# EAGLE design BMS Enerdel Adapter Fuse Holder rev1 (EAGLE 9.2.2)
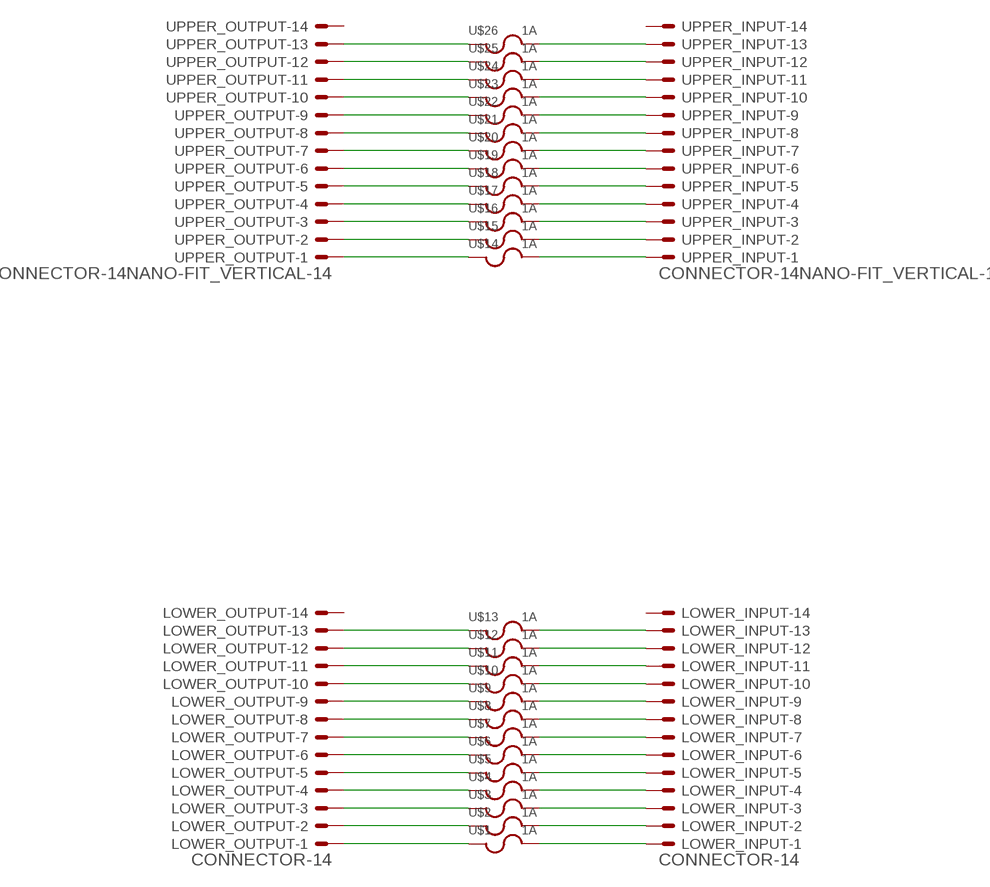
[diagram p0: schematic, sheet 1]

## Parts
LOWER_INPUT  CONNECTOR-14  [MINIFIT_5566-14]
LOWER_OUTPUT  CONNECTOR-14  [MINIFIT_5566-14]
U$1  1A  FUSE_5X20MM  [0751.0110]
U$2  1A  FUSE_5X20MM  [0751.0110]
U$3  1A  FUSE_5X20MM  [0751.0110]
U$4  1A  FUSE_5X20MM  [0751.0110]
U$5  1A  FUSE_5X20MM  [0751.0110]
U$6  1A  FUSE_5X20MM  [0751.0110]
U$7  1A  FUSE_5X20MM  [0751.0110]
U$8  1A  FUSE_5X20MM  [0751.0110]
U$9  1A  FUSE_5X20MM  [0751.0110]
U$10  1A  FUSE_5X20MM  [0751.0110]
U$11  1A  FUSE_5X20MM  [0751.0110]
U$12  1A  FUSE_5X20MM  [0751.0110]
U$13  1A  FUSE_5X20MM  [0751.0110]
U$14  1A  FUSE_5X20MM  [0751.0110]
U$15  1A  FUSE_5X20MM  [0751.0110]
U$16  1A  FUSE_5X20MM  [0751.0110]
U$17  1A  FUSE_5X20MM  [0751.0110]
U$18  1A  FUSE_5X20MM  [0751.0110]
U$19  1A  FUSE_5X20MM  [0751.0110]
U$20  1A  FUSE_5X20MM  [0751.0110]
U$21  1A  FUSE_5X20MM  [0751.0110]
U$22  1A  FUSE_5X20MM  [0751.0110]
U$23  1A  FUSE_5X20MM  [0751.0110]
U$24  1A  FUSE_5X20MM  [0751.0110]
U$25  1A  FUSE_5X20MM  [0751.0110]
U$26  1A  FUSE_5X20MM  [0751.0110]
UPPER_INPUT  CONNECTOR-14NANO-FIT_VERTICAL-14  [NANO-FIT_VERTICAL-14]
UPPER_OUTPUT  CONNECTOR-14NANO-FIT_VERTICAL-14  [NANO-FIT_VERTICAL-14]

## Nets
N$1: LOWER_OUTPUT.1 U$1.L1 U$1.L2
N$2: LOWER_OUTPUT.2 U$2.L1 U$2.L2
N$3: LOWER_OUTPUT.3 U$3.L1 U$3.L2
N$4: LOWER_OUTPUT.4 U$4.L1 U$4.L2
N$5: LOWER_OUTPUT.5 U$5.L1 U$5.L2
N$6: LOWER_OUTPUT.6 U$6.L1 U$6.L2
N$7: LOWER_OUTPUT.7 U$7.L1 U$7.L2
N$8: LOWER_OUTPUT.8 U$8.L1 U$8.L2
N$9: LOWER_OUTPUT.9 U$9.L1 U$9.L2
N$10: LOWER_OUTPUT.10 U$10.L1 U$10.L2
N$11: LOWER_OUTPUT.11 U$11.L1 U$11.L2
N$12: LOWER_OUTPUT.12 U$12.L1 U$12.L2
N$13: LOWER_OUTPUT.13 U$13.L1 U$13.L2
N$14: U$14.L1 U$14.L2 UPPER_OUTPUT.P$1
N$15: U$15.L1 U$15.L2 UPPER_OUTPUT.P$2
N$16: U$16.L1 U$16.L2 UPPER_OUTPUT.P$3
N$17: U$17.L1 U$17.L2 UPPER_OUTPUT.P$4
N$18: U$18.L1 U$18.L2 UPPER_OUTPUT.P$5
N$19: U$19.L1 U$19.L2 UPPER_OUTPUT.P$6
N$20: U$20.L1 U$20.L2 UPPER_OUTPUT.P$7
N$21: U$21.L1 U$21.L2 UPPER_OUTPUT.P$8
N$23: U$22.L1 U$22.L2 UPPER_OUTPUT.P$9
N$24: U$23.L1 U$23.L2 UPPER_OUTPUT.P$10
N$25: U$24.L1 U$24.L2 UPPER_OUTPUT.P$11
N$26: U$25.L1 U$25.L2 UPPER_OUTPUT.P$12
N$27: U$26.L1 U$26.L2 UPPER_OUTPUT.P$13
N$29: LOWER_INPUT.1 U$1.R1 U$1.R2
N$30: LOWER_INPUT.2 U$2.R1 U$2.R2
N$31: LOWER_INPUT.3 U$3.R1 U$3.R2
N$32: LOWER_INPUT.4 U$4.R1 U$4.R2
N$33: LOWER_INPUT.5 U$5.R1 U$5.R2
N$34: LOWER_INPUT.6 U$6.R1 U$6.R2
N$35: LOWER_INPUT.7 U$7.R1 U$7.R2
N$36: LOWER_INPUT.8 U$8.R1 U$8.R2
N$37: LOWER_INPUT.9 U$9.R1 U$9.R2
N$38: LOWER_INPUT.10 U$10.R1 U$10.R2
N$39: LOWER_INPUT.11 U$11.R1 U$11.R2
N$40: LOWER_INPUT.12 U$12.R1 U$12.R2
N$41: LOWER_INPUT.13 U$13.R1 U$13.R2
N$42: U$14.R1 U$14.R2 UPPER_INPUT.P$1
N$43: U$15.R1 U$15.R2 UPPER_INPUT.P$2
N$44: U$16.R1 U$16.R2 UPPER_INPUT.P$3
N$45: U$17.R1 U$17.R2 UPPER_INPUT.P$4
N$46: U$18.R1 U$18.R2 UPPER_INPUT.P$5
N$47: U$19.R1 U$19.R2 UPPER_INPUT.P$6
N$48: U$20.R1 U$20.R2 UPPER_INPUT.P$7
N$49: U$21.R1 U$21.R2 UPPER_INPUT.P$8
N$50: U$22.R1 U$22.R2 UPPER_INPUT.P$9
N$51: U$23.R1 U$23.R2 UPPER_INPUT.P$10
N$52: U$24.R1 U$24.R2 UPPER_INPUT.P$11
N$53: U$25.R1 U$25.R2 UPPER_INPUT.P$12
N$54: U$26.R1 U$26.R2 UPPER_INPUT.P$13
Unconnected: LOWER_INPUT.14 LOWER_OUTPUT.14 UPPER_INPUT.P$14 UPPER_OUTPUT.P$14

## Library data of the parts
LOWER_INPUT LOWER_OUTPUT UPPER_INPUT UPPER_OUTPUT = HyTechDevices:CONNECTOR-14: Mini-Fit Junior connector 14 pole Source: http://www.molex.com
U$1-U$26 = HyTechDevices:FUSE: Fuse/Fuseclips Keystone Electronics 3568 Fuse Mouser Part <http://www.mouser.com/ProductDetail/Keystone-Electronics/3568> Datasheet <http://www.mouser.com/ds/2/215/568-742601.pdf> Bussman/Eaton Midget Fuse Clip 1A3400 <http://www.mouser.com/ProductDetail/Bussmann-Eaton/BK-1A3400-09-R/?qs=sGAEpiMZZMuG%252bgnN5hGYGzzlAelq2OxnKqVSMVjq8I4%3d> Schurter 0751.0110 Brass Fuse Clip Datasheet <http://www.mouser.com/ds/2/358/typ_OG__Clip__5x20-2553.pdf>

## Board
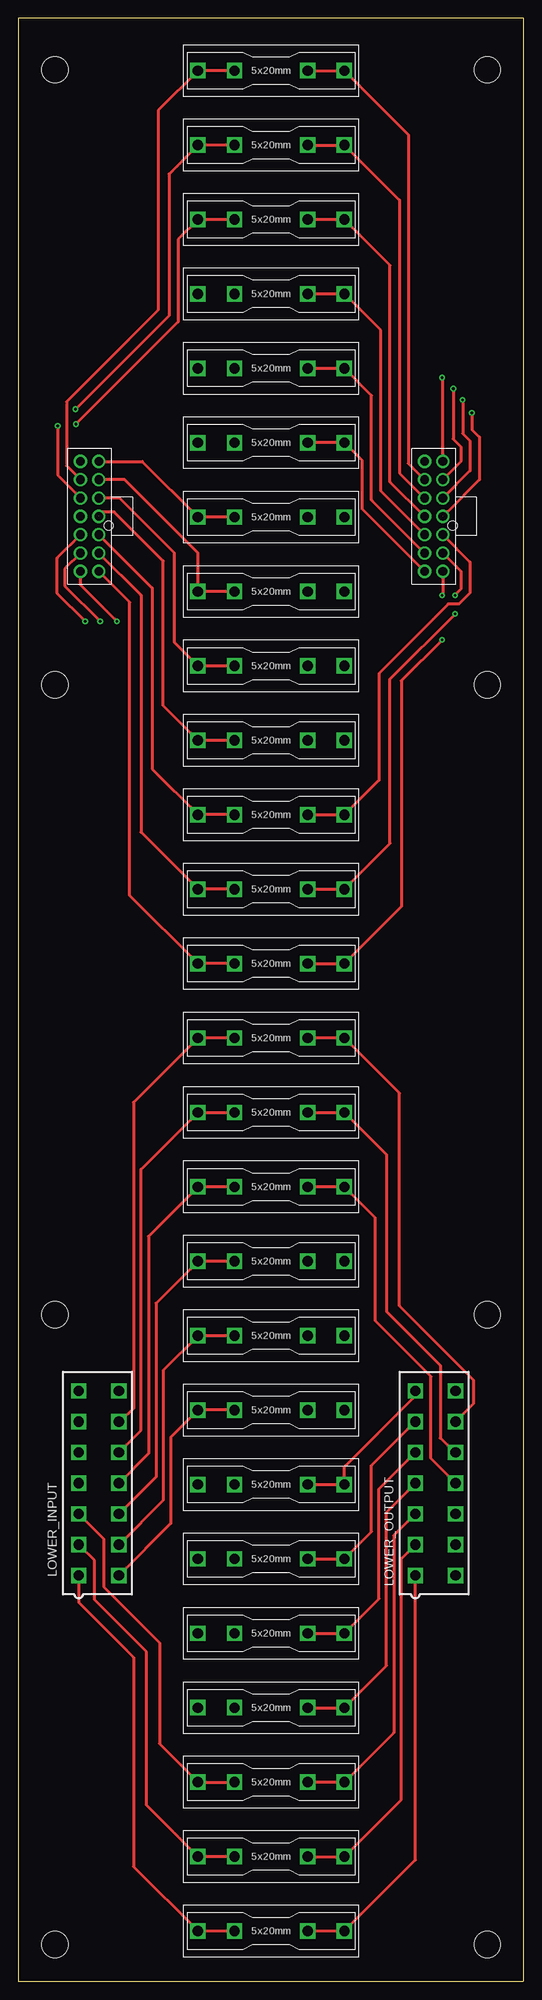
[diagram p1: board, top side]
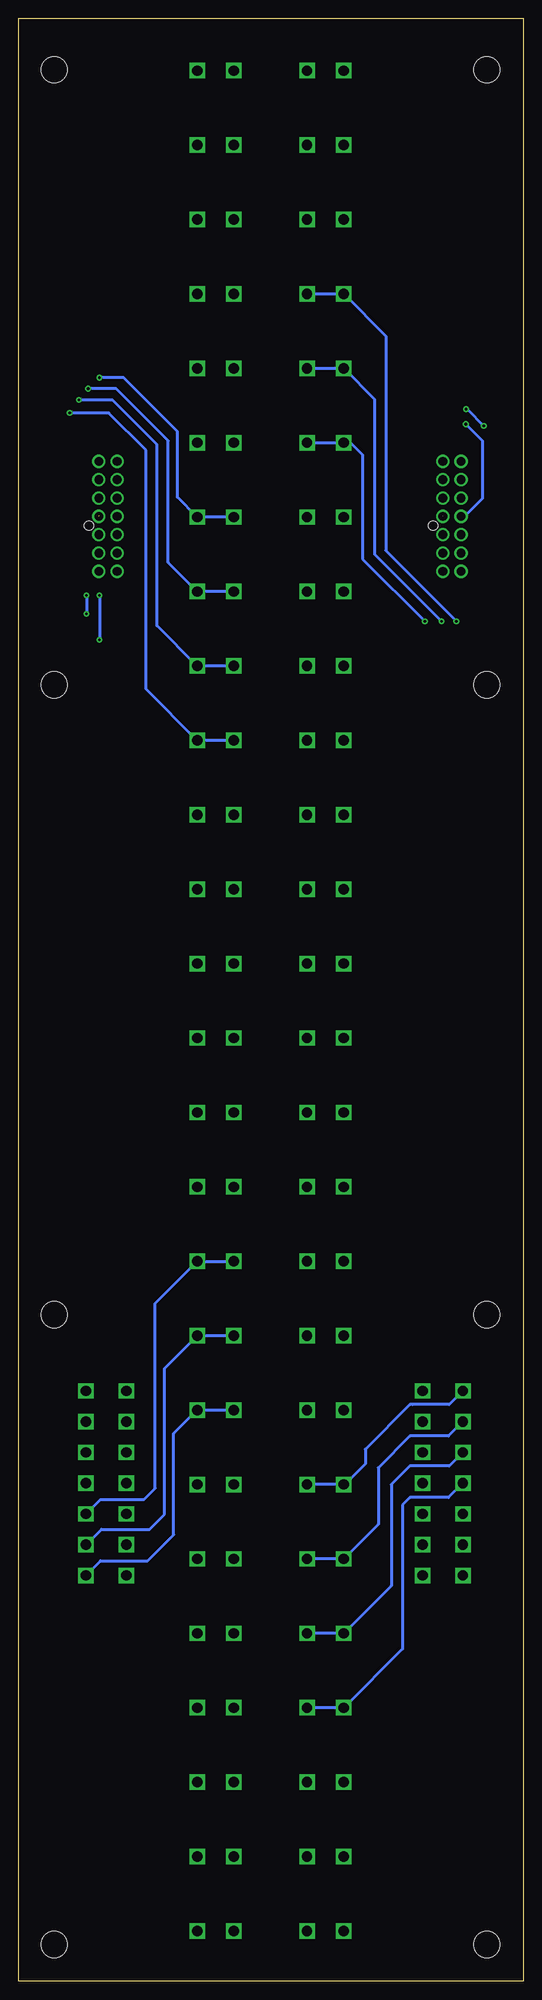
[diagram p2: board, bottom side, seen from below]

Size 69 x 268 mm. Coordinates in mm from the lower left corner, seen from the top.
Outline: 0,202.72 0,162.78
Outline: 0,122.78 0,82.84
Outline: 0,268 0,0 69,0 69,268 0,268
Copper layers (1*16): Top 0.035mm / dielectric 1.5mm / Bottom 0.035mm
Design rules "DRC Advanced Circuits *": minimum track width 6mil, minimum drill 15mil, track to track 24mil, track to pad 24mil, pad to pad 24mil, via to via 24mil, smd to smd 24mil, copper to edge 40mil, drill to drill 6mil, minimum pad ring 10mil, minimum via ring 8mil, stop-mask expansion 4mil, vias tented up to drill 0mil, thermal gap 10mil
Holes 3.6 mm at 5,261 64.09,261 5,5 64.09,177 64.09,91 64.09,5 5,91 5,177

### Footprints (pad centres in the part's own frame; a part is rotated, then mirrored left to right if it is on the bottom)
MINIFIT_5566-14 = drill 1.4 square: 1 12.6,-2.75; 2 8.4,-2.75; 3 4.2,-2.75; 4 0,-2.75; 5 -4.2,-2.75; 6 -8.4,-2.75; 7 -12.6,-2.75; 8 12.6,2.75; 9 8.4,2.75; 10 4.2,2.75; 11 0,2.75; 12 -4.2,2.75; 13 -8.4,2.75; 14 -12.6,2.75
0751.0110 = drill 1.4 square: L1 -10,0; L2 -5,0; R1 5,0; R2 10,0
NANO-FIT_VERTICAL-14 = drill 1.2: P$1 -7.5,0; P$2 -5,0; P$3 -2.5,0; P$4 0,0; P$5 2.5,0; P$6 5,0; P$7 7.5,0; P$8 -7.5,2.5; P$9 -5,2.5; P$10 -2.5,2.5; P$11 0,2.5; P$12 2.5,2.5; P$13 5,2.5; P$14 7.5,2.5 | hole 1.3: -1.27,-1.34

### Placement (x,y rotation side)
LOWER_INPUT  11,68 270 top
LOWER_OUTPUT  57,68 270 top
U$1  34.54,6.86 180 top
U$2  34.54,17.02 180 top
U$3  34.54,27.18 180 top
U$4  34.54,37.34 180 top
U$5  34.54,47.5 180 top
U$6  34.54,57.66 180 top
U$7  34.54,67.82 180 top
U$8  34.54,77.98 180 top
U$9  34.54,88.14 180 top
U$10  34.54,98.3 180 top
U$11  34.54,108.46 180 top
U$12  34.54,118.62 180 top
U$13  34.54,128.78 180 top
U$14  34.54,138.94 180 top
U$15  34.54,149.1 180 top
U$16  34.54,159.26 180 top
U$17  34.54,169.42 180 top
U$18  34.54,179.58 180 top
U$19  34.54,189.74 180 top
U$20  34.54,199.9 180 top
U$21  34.54,210.06 180 top
U$22  34.54,220.22 180 top
U$23  34.54,230.38 180 top
U$24  34.54,240.54 180 top
U$25  34.54,250.7 180 top
U$26  34.54,260.86 180 top
UPPER_INPUT  11,200 90 top
UPPER_OUTPUT  58,200 90 top

### Tracks (layer width: path | path; a pad name or v marks a point on that pad's centre or on a via)
N$1
  Top 0.406: U$1.L2 U$1.L1 54.25,16.56 LOWER_OUTPUT.1
N$2
  Top 0.406: U$2.L2 U$2.L1 52.32,24.8 52.32,57.67 LOWER_OUTPUT.2
N$3
  Top 0.406: LOWER_OUTPUT.3 51.31,60.86 51.31,33.94 U$3.L1 U$3.L2
N$4
  Top 0.406: U$4.L2 U$4.L1 50.29,43.08 50.29,64.04 LOWER_OUTPUT.4
N$5
  Top 0.406: U$5.L2 U$5.L1 49.28,52.23 49.28,67.23 LOWER_OUTPUT.5
N$6
  Top 0.406: U$6.L2 U$6.L1 48.26,61.37 48.26,70.41 LOWER_OUTPUT.6
N$7
  Top 0.406: U$7.L2 U$7.L1 44.54,70.2 54.25,79.9 LOWER_OUTPUT.7
N$8
  Bottom 0.406: LOWER_OUTPUT.8 57.75,57.4 51.31,57.4 47.75,60.96 47.75,74.77 U$8.L1 U$8.L2
N$9
  Bottom 0.406: U$9.L2 U$9.L1 49.02,83.66 49.02,63.75 51.05,61.72 57.63,61.72 LOWER_OUTPUT.9
N$10
  Bottom 0.406: LOWER_OUTPUT.10 57.77,65.78 51.82,65.78 50.29,67.31 50.29,92.55 U$10.L1 U$10.L2
N$11
  Top 0.406: LOWER_OUTPUT.11 56.39,71.36 56.39,82.55 48.77,90.17 48.77,104.23 U$11.L1 U$11.L2
N$12
  Top 0.406: U$12.L2 U$12.L1 50.29,112.87 50.29,91.44 57.66,84.07 57.66,74.17 59.62,72.2 LOWER_OUTPUT.12
N$13
  Top 0.406: LOWER_OUTPUT.13 62.23,78.88 62.23,82.04 52.07,92.2 52.07,121.25 U$13.L1 U$13.L2
N$14  (via drill 0.38)
  Top 0.406: U$14.L2 U$14.L1 52.32,146.72 52.32,177.54 v57.91,183.13 | UPPER_OUTPUT.P$1 58,189.32 v57.91,189.23
  Bottom 0.406: v57.91,189.23 v57.91,183.13
N$15  (via drill 0.38)
  Top 0.406: U$15.L2 U$15.L1 50.8,155.35 50.8,177.8 v59.69,186.69 | UPPER_OUTPUT.P$2 60.45,192.55 60.45,190.06 59.69,189.3 v59.69,189.23
  Bottom 0.406: v59.69,189.23 v59.69,186.69
N$16
  Top 0.406: U$16.L2 U$16.L1 49.28,163.99 49.28,178.56 58.74,188.02 60.19,188.02 61.72,189.55 61.72,193.78 UPPER_OUTPUT.P$3
N$17  (via drill 0.38)  (1 unrouted)
  Top 0.406: v61.98,214.12 61.98,211.83 62.99,210.82 62.99,204.99 58.6,200.6 58.57,200.6 57.98,200.02
  Bottom 0.406: U$17.L2 U$17.L1 51.56,176.43 51.56,209.04 56.64,214.12 v61.98,214.12
N$18  (via drill 0.38)
  Top 0.406: v60.71,215.9 60.71,211.33 61.72,210.31 61.72,206.22 UPPER_OUTPUT.P$5
  Bottom 0.406: U$18.L2 U$18.L1 50.04,185.07 50.04,209.8 56.13,215.9 v60.71,215.9
N$19  (via drill 0.38)
  Top 0.406: v59.44,217.42 59.44,210.56 60.45,209.55 60.45,207.45 UPPER_OUTPUT.P$6
  Bottom 0.406: U$19.L2 U$19.L1 48.51,193.71 48.51,210.31 55.63,217.42 v59.44,217.42
N$20  (via drill 0.38)
  Top 0.406: v57.91,218.95 57.91,207.59 UPPER_OUTPUT.P$7
  Bottom 0.406: U$20.L2 U$20.L1 47.24,202.6 47.24,211.58 54.61,218.95 v57.91,218.95
N$21
  Top 0.406: UPPER_OUTPUT.P$8 46.99,201.01 46.99,207.61 U$21.L1 U$21.L2
N$23
  Top 0.406: UPPER_OUTPUT.P$9 48.26,202.24 48.26,216.5 U$22.L1 U$22.L2
N$24
  Top 0.406: UPPER_OUTPUT.P$10 49.53,203.47 49.53,225.39 U$23.L1 U$23.L2
N$25
  Top 0.406: UPPER_OUTPUT.P$11 50.8,204.7 50.8,234.28 U$24.L1 U$24.L2
N$26
  Top 0.406: U$25.L2 U$25.L1 52.07,243.17 52.07,205.93 UPPER_OUTPUT.P$12
N$27
  Top 0.406: U$26.L2 U$26.L1 53.28,252.12 53.28,207.22 UPPER_OUTPUT.P$13
N$29
  Top 0.406: LOWER_INPUT.1 8.25,51.69 15.75,44.19 15.75,15.65 U$1.R2 U$1.R1
N$30
  Top 0.406: U$2.R1 U$2.R2 17.53,24.03 17.53,44.96 10.41,52.07 10.41,57.44 LOWER_INPUT.2
N$31
  Top 0.406: LOWER_INPUT.3 11.68,60.37 11.68,53.85 19.3,46.23 19.3,32.42 U$3.R2 U$3.R1
N$32
  Bottom 0.406: LOWER_INPUT.4 10.21,66.04 15.49,66.04 16.51,65.02 16.51,45.37 U$4.R2 U$4.R1
N$33
  Bottom 0.406: LOWER_INPUT.5 10.11,70.34 15.51,70.34 18.03,67.82 18.03,54.01 U$5.R2 U$5.R1
N$34
  Bottom 0.406: LOWER_INPUT.6 10.23,74.42 15.49,74.42 19.81,70.1 19.81,62.39 U$6.R2 U$6.R1
N$35
  Bottom 0.406: LOWER_INPUT.7 10.11,78.74 15.14,78.74 15.49,78.74 21.59,72.64 21.59,70.61 24.38,67.82 U$7.R2 U$7.R1
N$36
  Top 0.406: U$8.R1 U$8.R2 20.83,74.26 20.83,62.48 LOWER_INPUT.8
N$37
  Top 0.406: U$9.R1 U$9.R2 19.81,83.4 19.81,65.66 LOWER_INPUT.9
N$38
  Top 0.406: U$10.R1 U$10.R2 18.8,92.55 18.8,68.85 LOWER_INPUT.10
N$39
  Top 0.406: U$11.R1 U$11.R2 17.78,101.69 17.78,72.03 LOWER_INPUT.11
N$40
  Top 0.406: LOWER_INPUT.12 16.76,75.21 16.76,110.84 U$12.R2 U$12.R1
N$41
  Top 0.406: U$13.R1 U$13.R2 15.75,119.98 15.75,78.23 13.92,76.4 LOWER_INPUT.13
N$42
  Top 0.406: U$14.R1 U$14.R2 15.24,148.24 15.24,188.26 UPPER_INPUT.P$1
N$43
  Top 0.406: UPPER_INPUT.P$2 16.76,189.24 16.76,156.88 U$15.R2 U$15.R1
N$44
  Top 0.406: UPPER_INPUT.P$3 18.29,190.21 18.29,165.51 U$16.R2 U$16.R1
N$45  (1 unrouted)
  Top 0.406: U$17.R1 U$17.R2 19.81,174.15 19.81,193.9 13.11,200.6 11.57,200.6 10.98,200.02
N$46
  Top 0.406: U$18.R1 U$18.R2 21.34,182.78 21.34,195 13.84,202.5 UPPER_INPUT.P$5
N$47
  Top 0.406: U$19.R1 U$19.R2 24.54,195.01 14.56,205 UPPER_INPUT.P$6
N$48
  Top 0.406: UPPER_INPUT.P$7 16.94,207.5 U$20.R2 U$20.R1
N$49  (via drill 0.38)
  Top 0.406: v13.46,185.67 8.5,190.63 UPPER_INPUT.P$8
  Bottom 0.406: U$21.R1 U$21.R2 23.62,210.06 21.97,208.41 21.97,194.18 v13.46,185.67
N$50  (via drill 0.38)
  Top 0.406: UPPER_INPUT.P$9 6.35,192.85 6.35,190.5 v11.18,185.67
  Bottom 0.406: U$22.R1 U$22.R2 20.32,215.99 20.32,194.82 v11.18,185.67
N$51  (via drill 0.38)
  Top 0.406: v9.14,185.67 5.33,189.48 5.33,194.33 UPPER_INPUT.P$10
  Bottom 0.406: U$23.R1 U$23.R2 18.8,224.63 18.8,195.32 v9.14,185.67
N$52  (via drill 0.38)
  Top 0.406: U$24.R1 U$24.R2 21.84,237.84 21.84,226.57 v7.87,212.6
  Bottom 0.406: v7.87,212.6 5.59,210.31 5.59,202.44 8.02,200 UPPER_INPUT.P$11
N$53  (via drill 0.38)
  Top 0.406: v7.81,214.63 20.57,227.39 20.57,246.73 U$25.R2 U$25.R1 | v5.4,212.34 5.4,205.6 UPPER_INPUT.P$12
  Bottom 0.406: v7.81,214.63 7.68,214.63 v5.4,212.34
N$54
  Top 0.406: UPPER_INPUT.P$13 6.6,206.9 6.6,215.64 19.13,228.17 19.13,255.44 U$26.R2 U$26.R1

### Text on the board
tDocu: UPPER C12 | UPPER C11 | UPPER C10 | UPPER C9 | UPPER C8 | UPPER C7 | In | Out | UPPER C6 | DANGER HIGH VOLTAGE | DANGER HIGH VOLTAGE | UPPER C5 | UPPER C4 | UPPER C3 | UPPER C2 | UPPER C1 | UPPER C0 | BMS Adapter Fuse Holder 2019 rev1 | LOWER C12 | LOWER C11 | LOWER C10 | LOWER C9 | LOWER C8 | In | Out | LOWER C7 | LOWER C6 | DANGER HIGH VOLTAGE | DANGER HIGH VOLTAGE | LOWER C5 | LOWER C4 | LOWER C3 | LOWER C2 | LOWER C1 | LOWER C0
bDocu: DANGER HIGH VOLTAGE | DANGER HIGH VOLTAGE | BMS Adapter Fuse Holder 2019 rev1 | DANGER HIGH VOLTAGE | DANGER HIGH VOLTAGE